# Altium schematic sheet Stepper-Section.SchDoc
size A4; DocumentNumber: 5; SheetNumber: 5; SheetTotal: 10
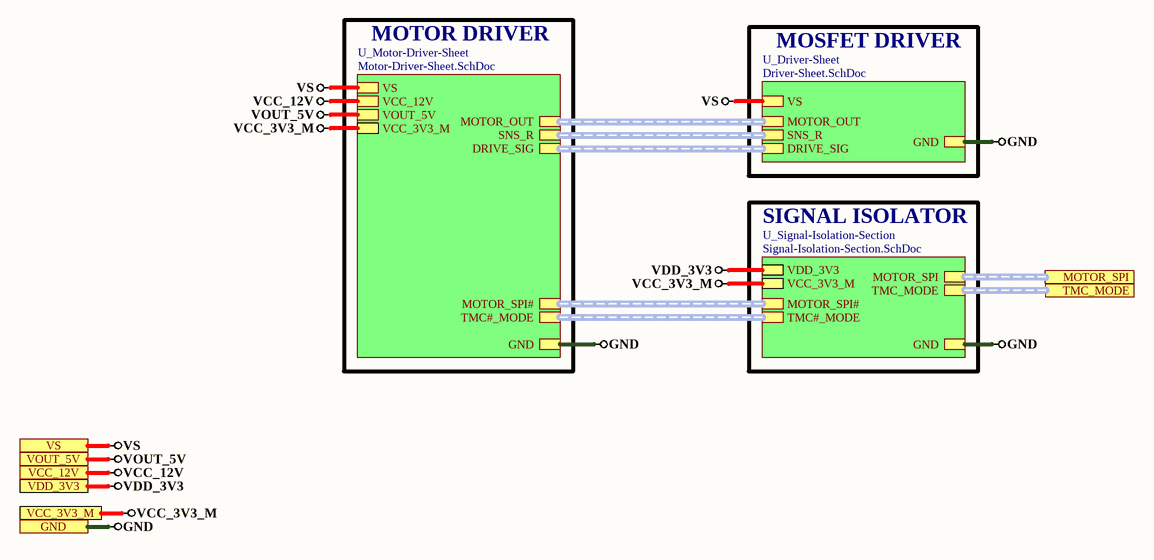
[diagram p0: Stepper-Section.SchDoc]

## Sub-sheets
U_Driver-Sheet = Driver-Sheet.SchDoc: MOTOR_OUT (harness MOTOR_OUT), GND, VS, SNS_R (harness SNS_R), DRIVE_SIG (harness DRIVE_SIG)
U_Motor-Driver-Sheet = Motor-Driver-Sheet.SchDoc: GND, VCC_12V, VS, MOTOR_OUT (harness MOTOR_OUT), SNS_R (harness SNS_R), DRIVE_SIG (harness DRIVE_SIG), TMC#_MODE (harness TMC#_MODE), MOTOR_SPI# (harness MOTOR_SPI#), VCC_3V3_M, VOUT_5V
U_Signal-Isolation-Section = Signal-Isolation-Section.SchDoc: MOTOR_SPI (harness MOTOR_SPI), MOTOR_SPI# (harness MOTOR_SPI#), VCC_3V3_M, GND, VDD_3V3, TMC_MODE (harness TMC_MODE), TMC#_MODE (harness TMC#_MODE)

## Ports
GND, MOTOR_SPI (harness MOTOR_SPI), TMC_MODE (harness TMC_MODE), VCC_3V3_M, VCC_12V, VDD_3V3, VOUT_5V, VS

## Nets
GND: port GND, sheet U_Driver-Sheet/GND, sheet U_Motor-Driver-Sheet/GND, sheet U_Signal-Isolation-Section/GND
VCC_3V3_M: port VCC_3V3_M, sheet U_Motor-Driver-Sheet/VCC_3V3_M, sheet U_Signal-Isolation-Section/VCC_3V3_M
VCC_12V: port VCC_12V, sheet U_Motor-Driver-Sheet/VCC_12V
VDD_3V3: port VDD_3V3, sheet U_Signal-Isolation-Section/VDD_3V3
VOUT_5V: port VOUT_5V, sheet U_Motor-Driver-Sheet/VOUT_5V
VS: port VS, sheet U_Driver-Sheet/VS, sheet U_Motor-Driver-Sheet/VS

## Buses and harness runs
harness port MOTOR_SPI = sheet U_Signal-Isolation-Section/MOTOR_SPI
harness port TMC_MODE = sheet U_Signal-Isolation-Section/TMC_MODE
harness sheet U_Driver-Sheet/DRIVE_SIG = sheet U_Motor-Driver-Sheet/DRIVE_SIG
harness sheet U_Driver-Sheet/MOTOR_OUT = sheet U_Motor-Driver-Sheet/MOTOR_OUT
harness sheet U_Driver-Sheet/SNS_R = sheet U_Motor-Driver-Sheet/SNS_R
harness sheet U_Motor-Driver-Sheet/MOTOR_SPI# = sheet U_Signal-Isolation-Section/MOTOR_SPI#
harness sheet U_Motor-Driver-Sheet/TMC#_MODE = sheet U_Signal-Isolation-Section/TMC#_MODE

## Notes on the sheet
- MOTOR DRIVER
- MOSFET DRIVER
- SIGNAL ISOLATOR